# EAGLE design board (EAGLE 6.2)
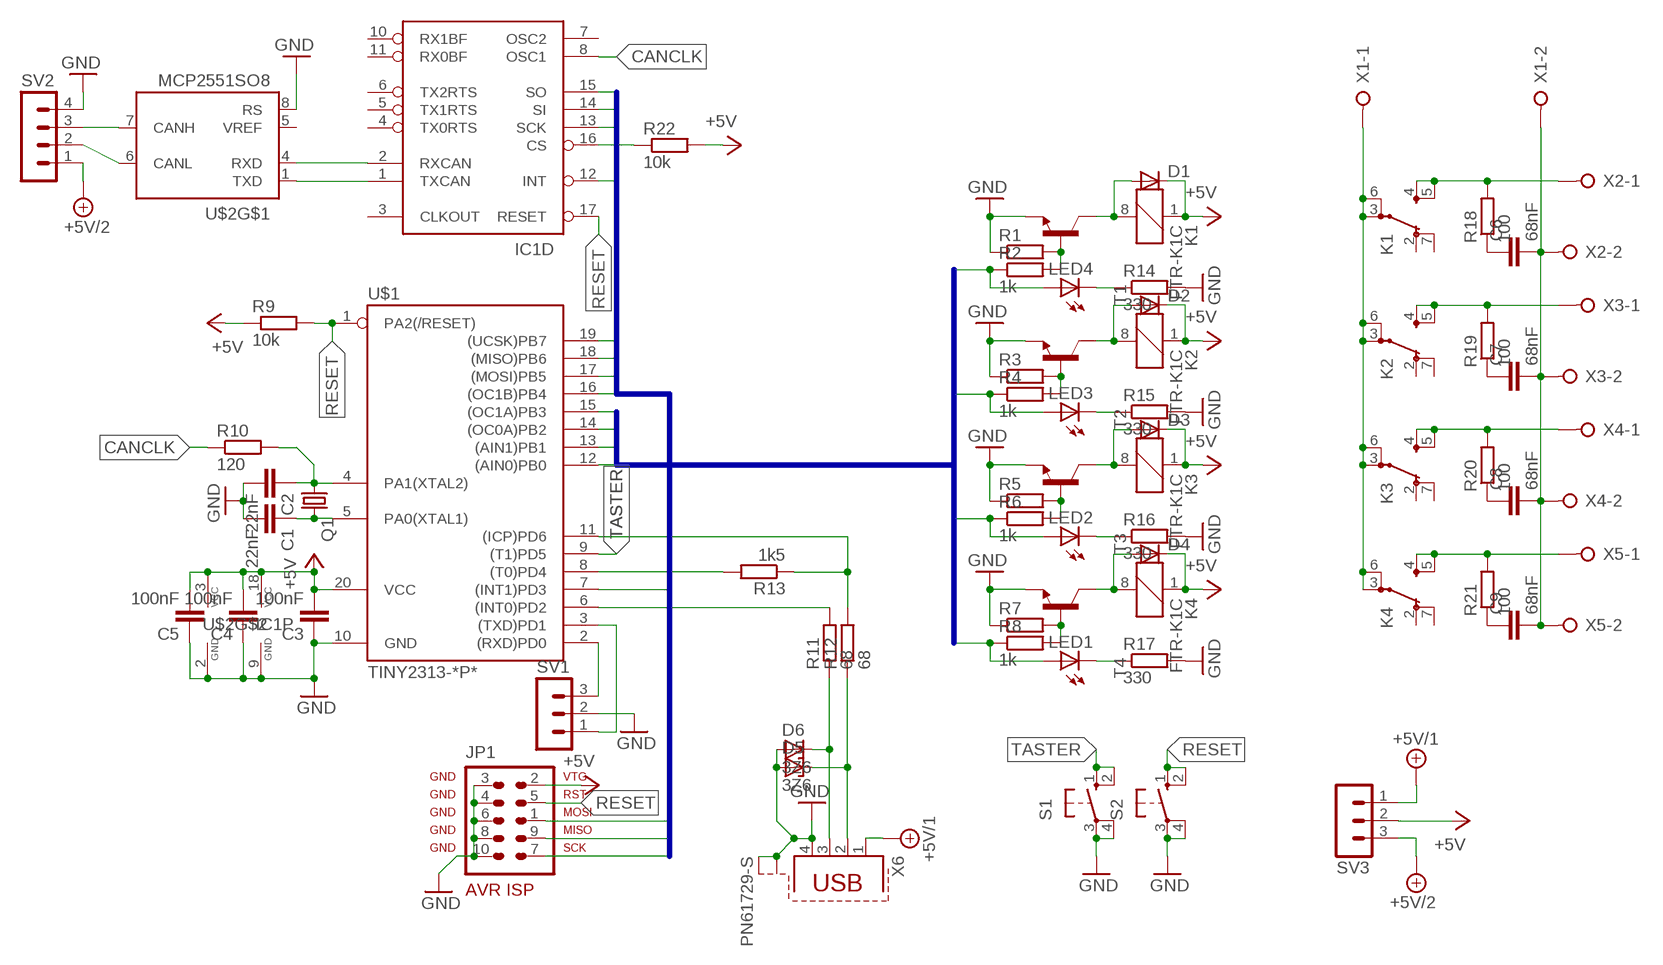
[diagram p0: schematic, sheet 1]

## Parts
C1  22nF  C-EUC0805  [C0805]
C2  22nF  C-EUC0805  [C0805]
C3  100nF  C-EUC0805  [C0805]
C4  100nF  C-EUC0805  [C0805]
C5  100nF  C-EUC0805  [C0805]
C6  68nF  C-EU150-084X183  [C150-084X183]
C7  68nF  C-EU150-084X183  [C150-084X183]
C8  68nF  C-EU150-084X183  [C150-084X183]
C9  68nF  C-EU150-084X183  [C150-084X183]
D1  DIODE-DO-214AC  [DO-214AC]
D2  DIODE-DO-214AC  [DO-214AC]
D3  DIODE-DO-214AC  [DO-214AC]
D4  DIODE-DO-214AC  [DO-214AC]
D5  3Z6  ZENER-DIODESMB  [SMB]
D6  3Z6  ZENER-DIODESMB  [SMB]
IC1  MCP2515SO  [SO-18W]
JP1  AVR-ISP-10  [AVR-ISP-10]
K1  FTR-K1C  [FTR-K1C]
K2  FTR-K1C  [FTR-K1C]
K3  FTR-K1C  [FTR-K1C]
K4  FTR-K1C  [FTR-K1C]
LED1  LED5MM  [LED5MM]
LED2  LED5MM  [LED5MM]
LED3  LED5MM  [LED5MM]
LED4  LED5MM  [LED5MM]
Q1  CRYSTALHC49U70  [HC49U70]
R1  R-EU_M0805  [M0805]
R2  1k  R-EU_M0805  [M0805]
R3  R-EU_M0805  [M0805]
R4  1k  R-EU_M0805  [M0805]
R5  R-EU_M0805  [M0805]
R6  1k  R-EU_M0805  [M0805]
R7  R-EU_M0805  [M0805]
R8  1k  R-EU_M0805  [M0805]
R9  10k  R-EU_M0805  [M0805]
R10  120  R-EU_M0805  [M0805]
R11  68  R-EU_M0805  [M0805]
R12  68  R-EU_M0805  [M0805]
R13  1k5  R-EU_M0805  [M0805]
R14  330  R-EU_M0805  [M0805]
R15  330  R-EU_M0805  [M0805]
R16  330  R-EU_M0805  [M0805]
R17  330  R-EU_M0805  [M0805]
R18  100  R-EU_0613/15  [P0613/15]
R19  100  R-EU_0613/15  [P0613/15]
R20  100  R-EU_0613/15  [P0613/15]
R21  100  R-EU_0613/15  [P0613/15]
R22  10k  R-EU_M0805  [M0805]
S1  10-XX  [B3F-10XX]
S2  10-XX  [B3F-10XX]
SV1  MA03-1  [MA03-1]
SV2  MA04-1  [MA04-1]
SV3  MA03-1  [MA03-1]
T1  -NPN-SOT23-EBC  [SOT23-EBC]
T2  -NPN-SOT23-EBC  [SOT23-EBC]
T3  -NPN-SOT23-EBC  [SOT23-EBC]
T4  -NPN-SOT23-EBC  [SOT23-EBC]
U$1  TINY2313-*P*  [DIL20]
U$2  MCP2551SO8  [SO08]
X1  W237-02P  [W237-132]
X2  W237-02P  [W237-132]
X3  W237-02P  [W237-132]
X4  W237-02P  [W237-132]
X5  W237-02P  [W237-132]
X6  PN61729-S  [PN61729-S]

## Nets
+5V: C3.2 C4.2 C5.2 D1.C D2.C D3.C D4.C IC1.18(P:VCC) JP1.2 K1.1 K2.1 K3.1 K4.1 R9.1 R22.2 SV3.2 U$1.20(VCC) U$2.3(VCC)
+5V/1: SV3.1 X6.1
+5V/2: SV2.1 SV3.3
CANCLK: IC1.8(D:OSC1) R10.1
CS: IC1.16(D:CS) R22.1 U$1.16((OC1B)PB4)
GND: C1.2 C2.2 C3.1 C4.1 C5.1 D5.A D6.A IC1.9(P:GND) JP1.3 JP1.4 JP1.6 JP1.8 JP1.10 R1.1 R3.1 R5.1 R7.1 R14.2 R15.2 R16.2 R17.2 S1.3(P) S1.4(P1) S2.3(P) S2.4(P1) SV1.2 SV2.4 T1.E T2.E T3.E T4.E U$1.10(GND) U$2.2(GND) U$2.8(RS) X6.4 X6.S1 X6.S2
INT: IC1.12(D:INT) U$1.7((INT1)PD3)
MISO: IC1.15(D:SO) JP1.9 U$1.18((MISO)PB6)
MOSI: IC1.14(D:SI) JP1.1 U$1.17((MOSI)PB5)
N$1: K1.3(-1:PA) K1.6(-1:PB) K2.3(-1:PA) K2.6(-1:PB) K3.3(-1:PA) K3.6(-1:PB) K4.3(-1:PA) K4.6(-1:PB) X1.1
N$2: C6.2 C7.2 C8.2 C9.2 X1.2 X2.2 X3.2 X4.2 X5.2
N$3: K1.4(-1:SA) K1.5(-1:SB) R18.2 X2.1
N$4: K2.4(-1:SA) K2.5(-1:SB) R19.2 X3.1
N$5: K3.4(-1:SA) K3.5(-1:SB) R20.2 X4.1
N$6: K4.4(-1:SA) K4.5(-1:SB) R21.2 X5.1
N$7: D1.A K1.8 T1.C
N$9: D2.A K2.8 T2.C
N$10: R1.2 R2.2 T1.B
N$11: D3.A K3.8 T3.C
N$12: R5.2 R6.2 T3.B
N$13: D4.A K4.8 T4.C
N$14: R7.2 R8.2 T4.B
N$15: C2.1 Q1.1 R10.2 U$1.4(PA1(XTAL2))
N$16: C1.1 Q1.2 U$1.5(PA0(XTAL1))
N$17: IC1.2(D:RXCAN) U$2.4(RXD)
N$18: IC1.1(D:TXCAN) U$2.1(TXD)
N$19: LED4.K(C) R14.1
N$20: R11.2 U$1.6((INT0)PD2)
N$21: D6.C R11.1 X6.3
N$22: D5.C R12.1 X6.2
N$23: LED3.K(C) R15.1
N$24: R12.2 R13.1 U$1.11((ICP)PD6)
N$25: SV1.1 U$1.3((TXD)PD1)
N$26: SV1.3 U$1.2((RXD)PD0)
N$27: LED2.K(C) R16.1
N$28: LED1.K(C) R17.1
N$29: R13.2 U$1.8((T0)PD4)
N$30: C6.1 R18.1
N$31: C9.1 R21.1
N$32: C8.1 R20.1
N$33: C7.1 R19.1
N$34: SV2.3 U$2.7(CANH)
N$35: SV2.2 U$2.6(CANL)
N$36: R3.2 R4.2 T2.B
RELAI0: LED1.A R8.1 U$1.12((AIN0)PB0)
RELAI1: LED2.A R6.1 U$1.13((AIN1)PB1)
RELAI2: LED3.A R4.1 U$1.14((OC0A)PB2)
RELAI3: LED4.A R2.1 U$1.15((OC1A)PB3)
RESET: IC1.17(D:RESET) JP1.5 R9.2 S2.1(S) S2.2(S1) U$1.1(PA2(/RESET))
SCK: IC1.13(D:SCK) JP1.7 U$1.19((UCSK)PB7)
TASTER: S1.1(S) S1.2(S1) U$1.9((T1)PD5)
Unconnected: IC1.3(D:CLKOUT) IC1.4(D:TX0RTS) IC1.5(D:TX1RTS) IC1.6(D:TX2RTS) IC1.7(D:OSC2) IC1.10(D:RX1BF) IC1.11(D:RX0BF) K1.2(-1:OA) K1.7(-1:OB) K2.2(-1:OA) K2.7(-1:OB) K3.2(-1:OA) K3.7(-1:OB) K4.2(-1:OA) K4.7(-1:OB) U$2.5(VREF)

## Buses
RELAI[0..3]
MISO,MOSI,SCK,CS,INT

## Library data of the parts
C1-C9 = rcl:C-EU: CAPACITOR, European symbol
D1-D4 = diode:DIODE-: DIODE
D5 D6 = diode:ZENER-DIODE: Z-Diode
IC1 = can:MCP2515: MC2515 Stand-Alone CAN Controller With SPI Interface, Microchip
JP1 = avr-7:AVR-ISP-10: AVR ISP-10 Serial Programming Header
K1-K4 = relay:FTR-K1C: NETZRELAIS FTR-K1CK024W1XUM 16A/250VAC 1 Umschaltkontakt Distributor: Conrad Electronic Bestell Nr.: 504389-13 - 24V Source: http://www.produktinfo.conrad.com/datenblaetter/500000-524999/504384-da-01-de-NETZRELAIS_FTR_K1CK012W1XUM_16A_250VAC.pdf; OC_FARNELL: unknown; OC_NEWARK: unknown
LED1-LED4 = led:LED: LED OSRAM: - CHIPLED LG R971, LG N971, LY N971, LG Q971, LY Q971, LO R971, LY R971 LH N974, LH R974 LS Q976, LO Q976, LY Q976 LO Q996 - Hyper CHIPLED LW Q18S LB Q993, LB Q99A, LB R99A - SideLED LS A670, LO A670, LY A670, LG A670, LP A670 LB A673, LV A673, LT A673, LW A673 LH A674 LY A675 LS A676, LA A676, LO A676, LY A676, LW A676 LS A679, LY A679, LG A679 - Hyper Micro SIDELED® LS Y876, LA Y876, LO Y876, LY Y876 LT Y87S - SmartLED LW L88C, LW L88S LB L89C, LB L89S, LG L890 LS L89K, LO L89K, LY L89K LS L896, LA L896, LO L896, LY L896 - TOPLED LS T670, LO T670, LY T670, LG T670, LP T670 LSG T670, LSP T670, LSY T670, LOP T670, LYG T670 LG T671, LOG T671, LSG T671 LB T673, LV T673, LT T673, LW T673 LH T674 LS T676, LA T676, LO T676, LY T676, LB T676, LH T676, LSB T676, LW T676 LB T67C, LV T67C, LT T67C, LS T67K, LO T67K, LY T67K, LW E67C LS E67B, LA E67B, LO E67B, LY E67B, LB E67C, LV E67C, LT E67C LW T67C LS T679, LY T679, LG T679 LS T770, LO T770, LY T770, LG T770, LP T770 LB T773, LV T773, LT T773, LW T773 LH T774 LS E675, LA E675, LY E675, LS T675 LS T776, LA T776, LO T776, LY T776, LB T776 LHGB T686 LT T68C, LB T68C - Hyper Mini TOPLED® LB M676 - Mini TOPLED Santana® LG M470 LS M47K, LO M47K, LY M47K Source: http://www.osram.convergy.de LUXEON: - LUMILED® LXK2-PW12-R00, LXK2-PW12-S00, LXK2-PW14-U00, LXK2-PW14-V00 LXK2-PM12-R00, LXK2-PM12-S00, LXK2-PM14-U00 LXK2-PE12-Q00, LXK2-PE12-R00, LXK2-PE12-S00, LXK2-PE14-T00, LXK2-PE14-U00 LXK2-PB12-K00, LXK2-PB12-L00, LXK2-PB12-M00, LXK2-PB14-N00, LXK2-PB14-P00, LXK2-PB14-Q00 LXK2-PR12-L00, LXK2-PR12-M00, LXK2-PR14-Q00, LXK2-PR14-R00 LXK2-PD12-Q00, LXK2-PD12-R00, LXK2-PD12-S00 LXK2-PH12-R00, LXK2-PH12-S00 LXK2-PL12-P00, LXK2-PL12-Q00, LXK2-PL12-R00 Source: www.luxeon.com KINGBRIGHT: KA-3528ASYC Source: www.kingbright.com
Q1 = crystal:CRYSTAL: CRYSTAL; OC_FARNELL: unknown; OC_NEWARK: unknown
R1-R22 = rcl:R-EU_: RESISTOR, European symbol
S1 S2 = switch-omron:10-XX: OMRON SWITCH; MPN: B3F-1000; OC_FARNELL: 176432; OC_NEWARK: 36M3542
SV1 SV3 = con-lstb:MA03-1: PIN HEADER; OC_FARNELL: unknown; OC_NEWARK: unknown
SV2 = con-lstb:MA04-1: PIN HEADER; OC_FARNELL: unknown; OC_NEWARK: unknown
T1-T4 = transistor-neu-to92:*-NPN-: NPN Transistror
U$1 = avr-7:TINY2313*: Atmel Tiny2313 2K Flash, 128 bytes EEPROM, 128 bytes RAM
U$2 = can:MCP2551: CAN Tranceiver Microchip
X1-X5 = con-wago-508:W237-02P: WAGO SREW CLAMP; OC_FARNELL: unknown; OC_NEWARK: unknown
X6 = con-berg:PN61729-S: BERG USB connector; OC_FARNELL: unknown; OC_NEWARK: unknown

## Board
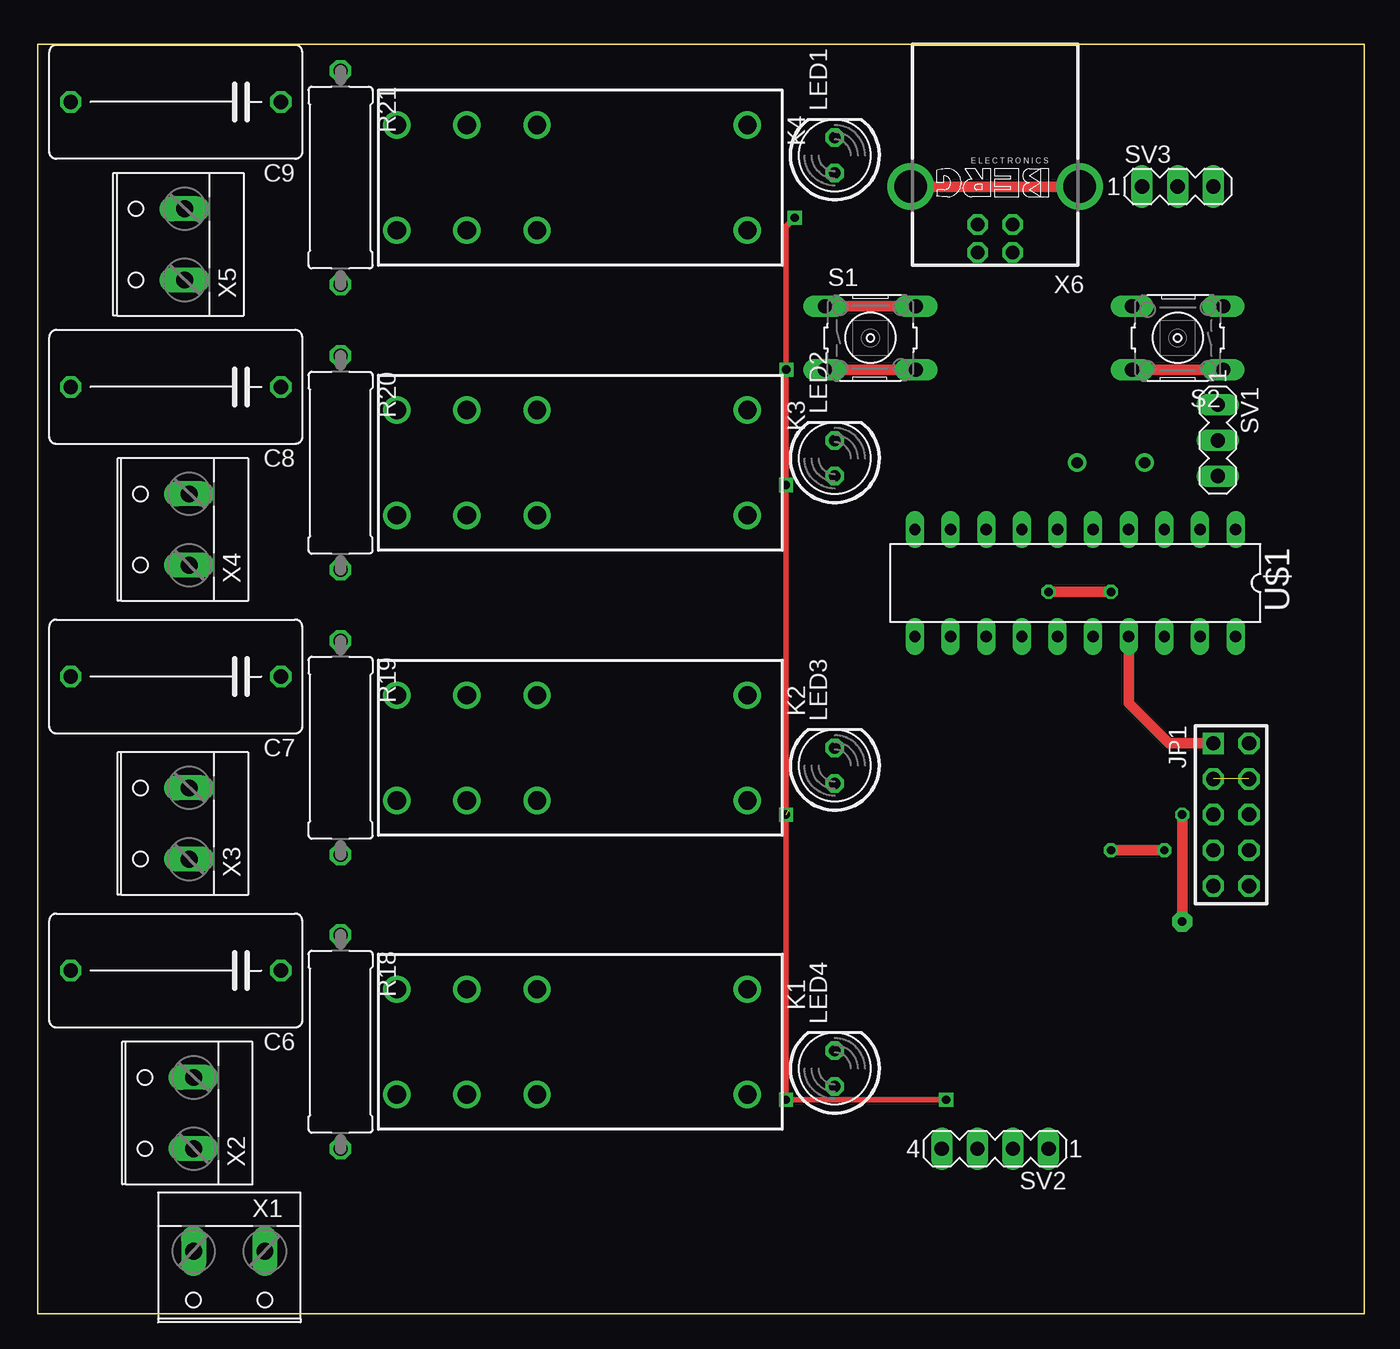
[diagram p1: board, top side]
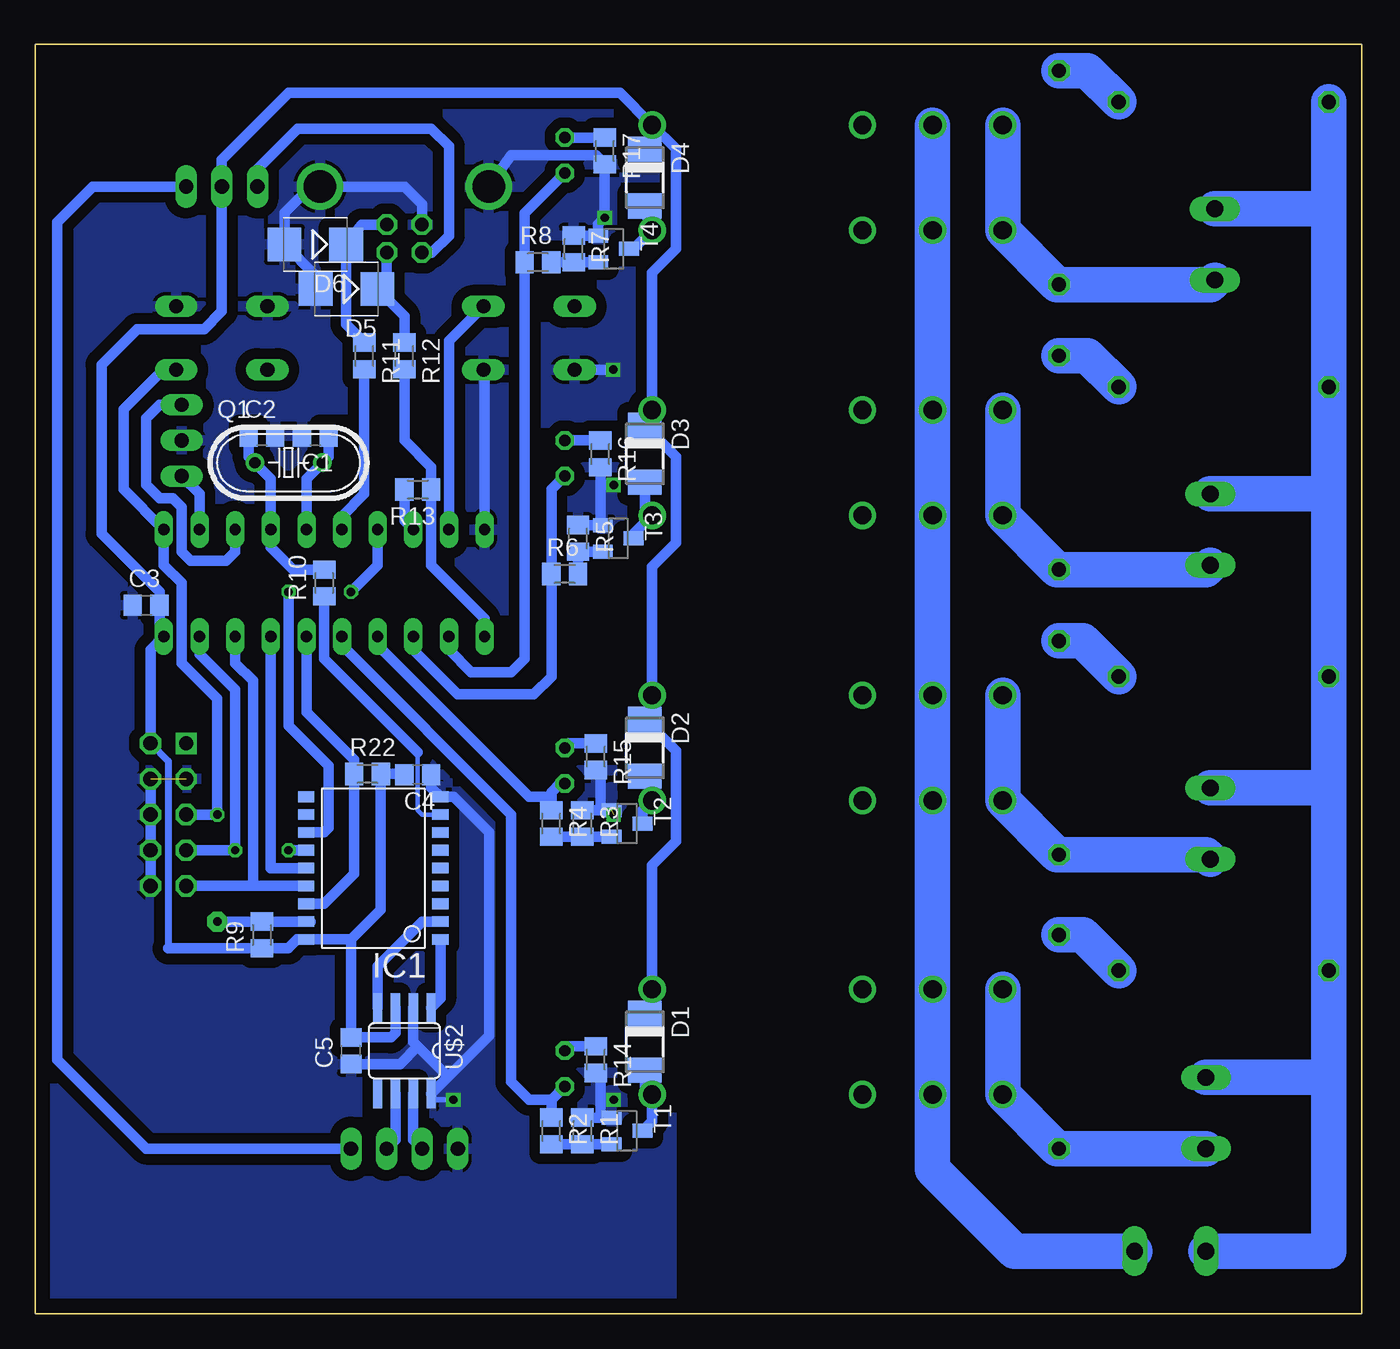
[diagram p2: board, bottom side, seen from below]

Size 94.59 x 90.47 mm. Coordinates in mm from the lower left corner, seen from the top.
Outline: 0,0 94.59,0 94.59,90.47 0,90.47 0,0
Copper layers (1*16): Top 0.035mm / dielectric 1.5mm / Bottom 0.035mm
Design rules: minimum track width 10mil, minimum drill 24mil, track to track 30mil, track to pad 30mil, pad to pad 30mil, via to via 30mil, smd to smd 15mil, copper to edge 40mil, drill to drill 8mil, minimum pad ring 10mil, minimum via ring 8mil, stop-mask expansion 4mil, vias tented up to drill 0mil, thermal gap 10mil

### Footprints (pad centres in the part's own frame; a part is rotated, then mirrored left to right if it is on the bottom)
C0805 = smd 1.3 x 1.5: 1 -0.95,0; 2 0.95,0
C150-084X183 = drill 1.016 octagon: 1 -7.493,0; 2 7.493,0
DO-214AC = smd 1.8 x 2.4: A 2.025,0; C -2.025,0
SMB = smd 2.4 x 2.4: A 2.2,0; C -2.2,0
SO-18W = smd 0.762 x 1.143: 1 -5.08,-4.788; 2 -3.81,-4.788; 3 -2.54,-4.788; 4 -1.27,-4.788; 5 0,-4.788; 6 1.27,-4.788; 7 2.54,-4.788; 8 3.81,-4.788; 9 5.08,-4.788; 10 5.08,4.788; 11 3.81,4.788; 12 2.54,4.788; 13 1.27,4.788; 14 0,4.788; 15 -1.27,4.788; 16 -2.54,4.788; 17 -3.81,4.788; 18 -5.08,4.788
AVR-ISP-10 = drill 1.016 square: 1 -5.08,-1.27 | drill 1.016 octagon: 2 -5.08,1.27; 3 -2.54,-1.27; 4 -2.54,1.27; 5 0,-1.27; 6 0,1.27; 7 2.54,-1.27; 8 2.54,1.27; 9 5.08,-1.27; 10 5.08,1.27
FTR-K1C = drill 1.3 pad 1.93: 1 -12.5,-3.75; 2 2.5,-3.75; 3 7.5,-3.75; 4 12.5,-3.75; 5 12.5,3.75; 6 7.5,3.75; 7 2.5,3.75; 8 -12.5,3.75
LED5MM = drill 0.813 octagon: A -1.27,0; K 1.27,0
HC49U70 = drill 0.813: 1 -2.413,0; 2 2.413,0
M0805 = smd 1.3 x 1.6: 1 -0.95,0; 2 0.95,0
P0613/15 = drill 1.016 octagon: 1 -7.62,0; 2 7.62,0
B3F-10XX = drill 1.016 long: 1 -3.251,2.261; 2 3.251,2.261; 3 -3.251,-2.261; 4 3.251,-2.261
MA03-1 = drill 1.016 long: 1 -2.54,0; 2 0,0; 3 2.54,0
MA04-1 = drill 1.016 long: 1 -3.81,0; 2 -1.27,0; 3 1.27,0; 4 3.81,0
SOT23-EBC = smd 1 x 1.4: B 0.95,-1.1; C 0,1.1; E -0.95,-1.1
DIL20 = drill 0.813 long: 1 -11.43,-3.81; 2 -8.89,-3.81; 3 -6.35,-3.81; 4 -3.81,-3.81; 5 -1.27,-3.81; 6 1.27,-3.81; 7 3.81,-3.81; 8 6.35,-3.81; 9 8.89,-3.81; 10 11.43,-3.81; 11 11.43,3.81; 12 8.89,3.81; 13 6.35,3.81; 14 3.81,3.81; 15 1.27,3.81; 16 -1.27,3.81; 17 -3.81,3.81; 18 -6.35,3.81; 19 -8.89,3.81; 20 -11.43,3.81
SO08 = smd 0.66 x 2.032: 1 -1.905,-3.073; 2 -0.635,-3.073; 3 0.635,-3.073; 4 1.905,-3.073; 5 1.905,3.073; 6 0.635,3.073; 7 -0.635,3.073; 8 -1.905,3.073
W237-132 = drill 1.194 long: 1 -2.54,-0.635; 2 2.54,-0.635
PN61729-S = drill 0.95 octagon: 1 1.25,4.71; 2 -1.25,4.71; 3 -1.25,2.71; 4 1.25,2.71 | drill 2.3 pad 2.9: S1 -6.02,0; S2 6.02,0

### Placement (x,y rotation side)
C1  74.61,62.55 180 bottom
C2  78.42,62.55 0 bottom
C3  86.68,50.48 0 bottom
C4  67.31,38.42 180 bottom
C5  72.07,18.73 90 bottom
C6  9.84,24.45 180 top
C7  9.84,45.4 180 top
C8  9.84,66.04 180 top
C9  9.84,86.36 180 top
D1  51.12,19.37 270 bottom
D2  51.12,40.32 270 bottom
D3  51.12,61.28 270 bottom
D4  51.12,80.96 270 bottom
D5  72.39,73.03 180 bottom
D6  74.61,76.2 180 bottom
IC1  70.48,31.75 90 bottom
JP1  85.09,35.56 270 top
K1  38.1,19.37 180 top
K2  38.1,40.32 180 top
K3  38.1,60.64 180 top
K4  38.1,80.96 180 top
LED1  56.83,82.55 90 top
LED2  56.83,60.96 90 top
LED3  56.83,39.05 90 top
LED4  56.83,17.46 90 top
Q1  76.52,60.64 0 bottom
R1  55.56,13.02 270 bottom
R2  57.78,13.02 270 bottom
R3  55.56,34.92 270 bottom
R4  57.78,34.92 270 bottom
R5  55.88,55.24 270 bottom
R6  56.83,52.7 0 bottom
R7  56.2,75.88 270 bottom
R8  58.74,74.93 0 bottom
R9  78.42,26.99 90 bottom
R10  73.98,52.07 90 bottom
R11  71.12,68.26 270 bottom
R12  68.26,68.26 270 bottom
R13  67.31,58.74 180 bottom
R14  54.61,18.1 270 bottom
R15  54.61,39.69 270 bottom
R16  54.29,61.28 270 bottom
R17  53.98,82.87 270 bottom
R18  21.59,19.37 270 top
R19  21.59,40.32 270 top
R20  21.59,60.64 270 top
R21  21.59,80.96 270 top
R22  70.9,38.46 0 bottom
S1  59.37,69.53 0 top
S2  81.28,69.53 180 top
SV1  84.14,62.23 270 top
SV2  68.26,11.75 180 top
SV3  81.28,80.33 0 top
T1  52.39,13.02 270 bottom
T2  52.39,34.92 270 bottom
T3  53.02,55.24 270 bottom
T4  53.34,75.88 270 bottom
U$1  73.98,52.07 180 top
U$2  68.26,18.73 180 bottom
X1  13.65,3.81 180 top
X2  10.48,14.29 90 top
X3  10.16,34.92 90 top
X4  10.16,55.88 90 top
X5  9.84,76.2 90 top
X6  68.26,80.33 180 top

### Tracks (layer width: path | path; a pad name or v marks a point on that pad's centre or on a via)
+5V
  Bottom 0.305: 50.66,84.77 K4.1
  Bottom 0.508: JP1.2 85.09,39.37 85.09,26.04
  Bottom 0.762: 85.09,26.04 R9.1 | R9.1 | D1.C 50.6,21.59 K1.1 50.6,31.95 48.9,33.66 48.9,40.12 D2.C 50.6,42.55 K2.1 50.6,53.22 48.9,54.93 48.9,61.08 D3.C 50.6,62.78 K3.1 50.6,74.18 48.9,75.88 48.9,83.01 K4.1 50.6,83.19 D4.C | R9.1 76.54,26.04 75.91,26.67 IC1.18 72.07,26.67 | U$2.3 68.9,20 69.22,19.68 C5.2 | C5.2 72.07,26.67 | 72.07,26.67 69.94,28.8 R22.2 68.3,38.46 C4.2 68.58,38.42 | C5.2 | 50.66,84.77 52.88,87 76.52,87 81.28,82.23 SV3.2 81.28,71.44 82.55,70.17 87.31,70.17 89.85,67.63 89.85,55.56 85.72,51.44 C3.2 | C3.2 | C3.2 85.72,48.58 U$1.20 86.36,47.31 JP1.2
+5V/1
  Bottom 0.762: X6.1 66.31,75.62 65.09,76.83 65.09,83.19 66.36,84.45 75.88,84.45 78.74,81.6 SV3.1
+5V/2
  Bottom 0.762: SV3.3 90.49,80.33 93.03,77.79 93.03,18.1 86.68,11.75 SV2.1
CANCLK
  Bottom 0.305: 67.31,40.01 67.31,35.88 66.99,35.56 IC1.8
  Bottom 0.762: R10.1 73.98,46.67 67.31,40.01
CS
  Bottom 0.406: 75.25,43.22 75.25,43.18
  Bottom 0.762: U$1.16 75.25,43.18 75.25,42.86 71.84,39.46 R22.1 71.84,31.34 73.98,29.21 IC1.16
GND  (via drill 0.6)  (2 unrouted)
  Top 0.381: v53.98,78.11 53.34,77.47 53.34,67.31 v53.34,59.05 v53.34,35.56 v53.34,15.24 v64.77,15.24
  Top 0.762: S1.4 S1.3 | v53.38,67.27 53.34,67.31 | X6.S2 X6.S1
  Bottom 0.381: 53.02,15.24 v53.34,15.24 | v64.77,15.24 66.04,15.24 66.36,15.56 U$2.8
  Bottom 0.762: JP1.4 JP1.6 JP1.8 JP1.10 | 65.14,16.88 62.23,19.79 62.23,34.29 64.77,36.83 IC1.9 66.36,37.49 C4.1 | 65.14,16.88 U$2.8 | U$1.10 62.55,66.4 S1.4 | S1.3 v53.38,67.27 53.34,67.31 | X6.S2 60.64,82.55 54.61,82.55 R17.2 v53.98,78.11 54.44,77.64 T4.E R7.1 | X6.4 67.01,79.08 68.26,80.33 X6.S1 74.93,80.33 76.81,78.44 D6.A 74.59,73.98 D5.A | U$2.2 67.63,19.37 67.31,19.05 | 67.31,19.05 65.14,16.88 | C5.1 68.58,17.78 67.31,19.05 | R1.1 54.29,13.97 | 54.29,13.97 T1.E | R14.2 54.29,16.83 54.29,13.97 | T2.E 54.29,35.88 | 54.29,35.88 R3.1 | R15.2 54.29,38.42 54.29,35.88 | R5.1 T3.E 54.29,56.37 54.29,59.05 | R16.2 54.29,59.05 | v53.34,59.05 54.29,59.05
  pour Bottom: 49.21,91.44 49.21,-0.95 96.84,-0.95 96.84,91.44
INT  (via drill 0.6)
  Top 0.762: v76.52,51.44 v72.07,51.44
  Bottom 0.762: U$1.7 70.17,53.34 v72.07,51.44 | IC1.12 73.98,34.29 73.66,34.61 73.66,39.05 76.52,41.91 v76.52,51.44
MISO
  Bottom 0.762: IC1.15 79.06,30.48 | 79.06,30.48 79.06,45.09 80.33,46.35 U$1.18 | 79.06,30.48 JP1.9
MOSI
  Top 0.762: JP1.1 80.64,40.64 77.79,43.5 U$1.17
  Bottom 0.762: IC1.14 77.79,31.75 U$1.17
N$1
  Bottom 2.54: K4.3 K4.6 K3.3 K3.6 K2.3 K2.6 K1.3 K1.6 30.6,10.28 24.77,4.45 X1.1
N$2
  Bottom 2.54: X1.2 2.35,4.45 2.35,16.83 | 2.35,16.83 C6.2 2.35,37.47 | 2.35,37.47 C7.2 2.35,58.42 | 2.35,58.42 C8.2 2.35,78.74 | 2.35,78.74 C9.2 | X5.2 2.35,78.74 | X4.2 2.35,58.42 | X3.2 2.35,37.47 | X2.2 2.35,16.83
N$3
  Bottom 2.54: X2.1 R18.2 21.73,11.75 K1.5 K1.4
N$4
  Bottom 2.54: K2.4 K2.5 21.73,32.7 R19.2 11.11,32.7 X3.1
N$5
  Bottom 2.54: K3.4 K3.5 21.73,53.02 R20.2 11.11,53.02 X4.1
N$6
  Bottom 2.54: K4.4 K4.5 21.73,73.34 R21.2 10.79,73.34 X5.1
N$7
  Bottom 0.762: D1.A 51.12,16.14 K1.8 50.6,13.71 T1.C
N$9
  Bottom 0.762: D2.A 50.6,37.78 K2.8 51.29,35.88 T2.C
N$10
  Bottom 0.762: T1.B R1.2 R2.2
N$11
  Bottom 0.762: D3.A 51.12,57.33 K3.8 51.92,55.57 T3.C
N$12
  Bottom 0.762: R6.2 R5.2 T3.B
N$13
  Bottom 0.762: D4.A 50.8,77.41 K4.8 51.93,75.88 T4.C
N$14
  Bottom 0.762: T4.B R7.2 R8.2
N$15
  Bottom 0.762: R10.2 76.2,53.02 77.79,54.61 U$1.4 77.79,59.5 Q1.1 79.37,61.08 C2.1
N$16
  Bottom 0.762: C1.1 73.66,61.08 Q1.2 75.25,59.5 U$1.5
N$17
  Bottom 0.762: IC1.2 66.99,27.94 70.17,24.77 U$2.4
N$18
  Bottom 0.762: IC1.1 65.7,22.47 U$2.1
N$19
  Bottom 0.762: LED4.K 56.52,19.05 R14.1
N$20
  Bottom 0.762: U$1.6 72.71,56.83 71.12,58.42 R11.2
N$21
  Bottom 0.762: X6.3 71.31,77.62 D6.C 72.41,70.5 R11.1
N$22
  Bottom 0.762: X6.2 69.51,73.7 D5.C 68.26,71.09 R12.1
N$23
  Bottom 0.762: LED3.K 56.52,40.64 R15.1
N$24
  Bottom 0.762: U$1.11 62.55,49.53 66.36,53.34 R13.1 66.36,60.33 68.26,62.23 R12.2
N$25
  Bottom 0.762: SV1.1 85.72,64.77 86.68,63.82 86.68,59.05 85.72,58.1 84.77,58.1 84.14,57.47 84.14,54.29 83.5,53.66 80.96,53.66 80.33,54.29 U$1.3
N$26
  Bottom 0.762: U$1.2 82.87,58.42 SV1.3
N$27
  Bottom 0.762: R16.1 LED2.K
N$28
  Bottom 0.762: R17.1 LED1.K
N$29
  Bottom 0.762: U$1.8 68.26,56.51 R13.2
N$30
  Bottom 2.54: R18.1 19.88,26.99 C6.1
N$31
  Bottom 2.54: C9.1 19.56,88.58 R21.1
N$32
  Bottom 2.54: R20.1 19.56,68.26 C8.1
N$33
  Bottom 2.54: R19.1 19.88,47.94 C7.1
N$34
  Bottom 0.762: U$2.7 67.63,12.38 SV2.3
N$35
  Bottom 0.762: U$2.6 68.9,12.38 SV2.2
N$36
  Bottom 0.762: T2.B R3.2 R4.2
RELAI0
  Bottom 0.762: U$1.12 65.09,47.31 63.5,45.72 60.64,45.72 59.69,46.67 R8.1 59.69,78.42 LED1.A
RELAI1
  Bottom 0.762: U$1.13 67.63,47.31 64.45,44.13 59.05,44.13 57.78,45.4 R6.1 57.78,58.74 LED2.A
RELAI2
  Bottom 0.762: LED3.A 57.15,37.78 57.78,37.15 57.78,36.83 | 57.78,36.83 R4.1 | U$1.14 70.17,47.62 59.37,36.83 57.78,36.83
RELAI3
  Bottom 0.762: U$1.15 72.71,47.62 60.64,35.56 60.64,16.51 59.38,15.24 57.78,15.24 | LED4.A 57.78,15.24 | 57.78,15.24 R2.1
RESET  (via drill 0.6 pad 0.81, 0.6 pad 1.42)
  Top 0.762: v81.6,35.56 v81.6,27.94 | S2.1 S2.2
  Bottom 0.762: IC1.17 74.96,27.94 R9.2 v81.6,27.94 | JP1.5 v81.6,35.56 81.6,43.81 84.14,46.35 84.14,52.07 85.41,53.34 U$1.1 88.27,58.74 88.27,64.45 85.45,67.27 S2.1
SCK  (via drill 0.6, 0.6 pad 1.02)
  Top 0.762: v76.52,33.02 v80.33,33.02
  Bottom 0.762: U$1.19 82.87,46.99 80.33,44.45 v80.33,33.02 JP1.7 | IC1.13 v76.52,33.02
TASTER
  Top 0.762: S1.2 S1.1
  Bottom 0.762: S1.2 65.09,69.33 U$1.9